# Altium schematic sheet NodoWifi_BLK_R00.SchDoc
size A4; SheetNumber: 1; SheetTotal: 5
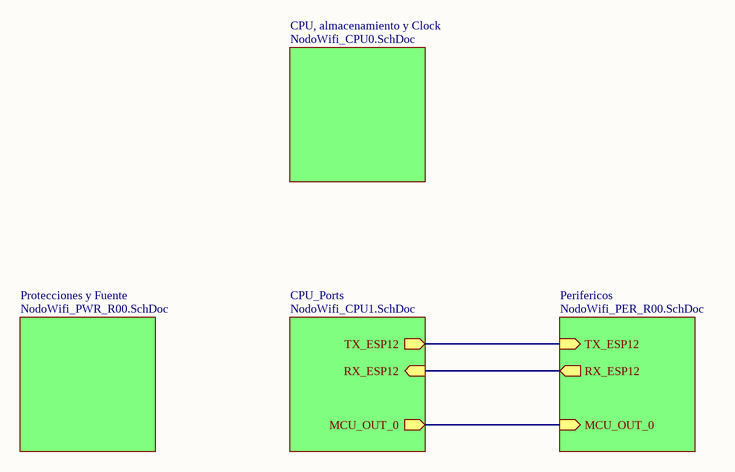
[diagram p0: NodoWifi_BLK_R00.SchDoc]

## Sub-sheets
CPU, almacenamiento y Clock = NodoWifi_CPU0.SchDoc: no entries
CPU_Ports = NodoWifi_CPU1.SchDoc: TX_ESP12 (out), RX_ESP12 (in), MCU_OUT_0 (out)
Perifericos = NodoWifi_PER_R00.SchDoc: TX_ESP12 (in), RX_ESP12 (out), MCU_OUT_0 (in)
Protecciones y Fuente = NodoWifi_PWR_R00.SchDoc: no entries

## Nets
(unnamed): sheet CPU_Ports/TX_ESP12, sheet Perifericos/TX_ESP12
(unnamed): sheet CPU_Ports/RX_ESP12, sheet Perifericos/RX_ESP12
(unnamed): sheet CPU_Ports/MCU_OUT_0, sheet Perifericos/MCU_OUT_0